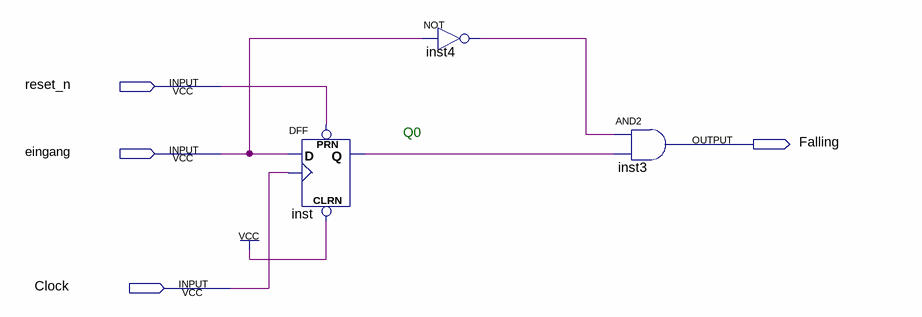
[diagram p0: schematic sheet]
// Quartus schematic falling_edge_detector.bdf as structural Verilog: 3 symbols, 4 pins
module falling_edge_detector (
  input  reset_n,
  input  eingang,
  input  Clock,
  output Falling
);

  wire inst4_out, inst_q;

  DFF inst (.CLRN(1'b1), .CLK(Clock), .D(eingang), .PRN(reset_n), .Q(inst_q));
  not inst4 (inst4_out, eingang);
  and inst3 (Falling, inst4_out, inst_q);

  // Notes on the sheet:
  //   Q0
endmodule
